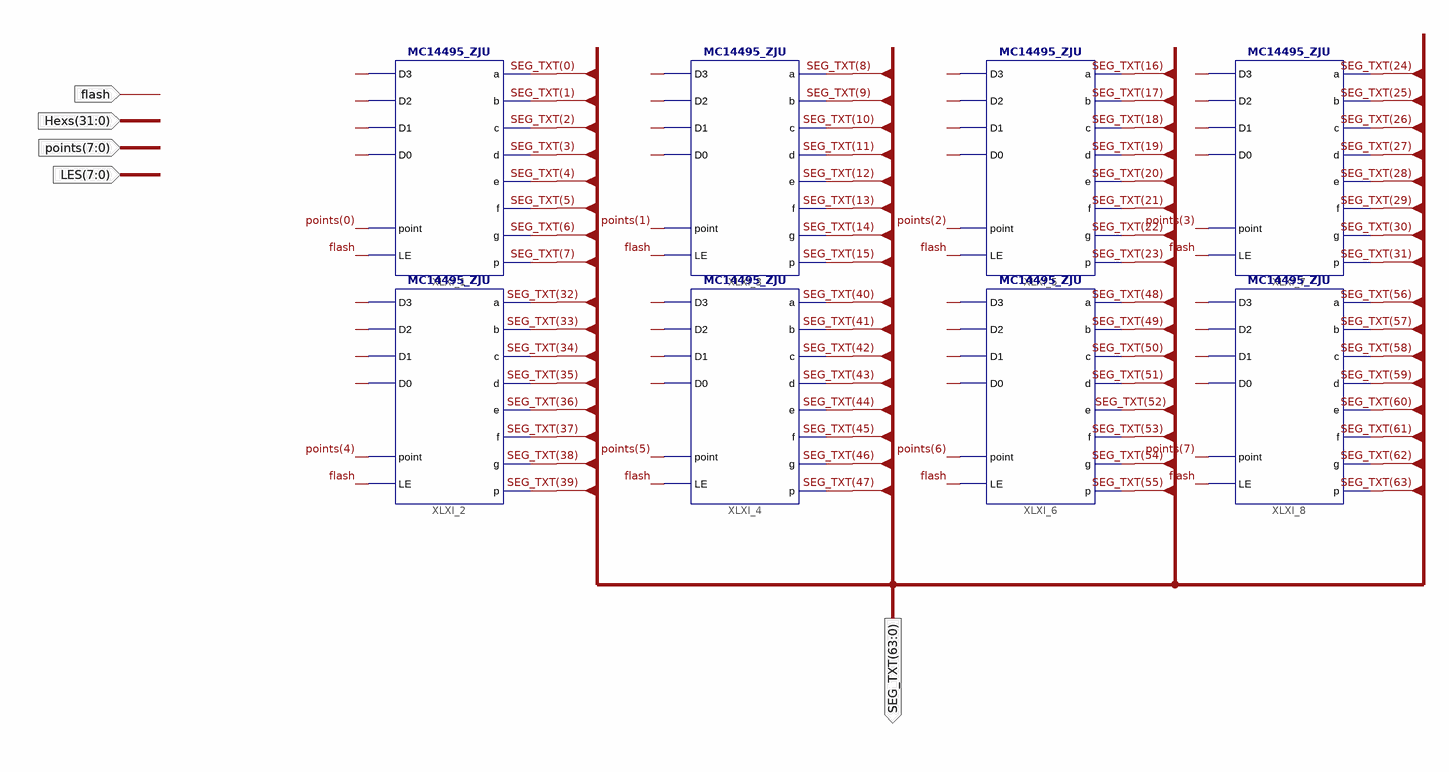
[diagram p0: schematic sheet 1]
// Xilinx ISE schematic HexT8Seg.sch (kintex7) as structural Verilog: 8 symbols, 5 ports
module HexT8Seg (
  input  flash,
  input  [31:0] Hexs,
  input  [7:0] points,
  input  [7:0] LES,
  output [63:0] SEG_TXT
);

  wire XLXN_79, XLXN_80, XLXN_81, XLXN_82, XLXN_85, XLXN_86, XLXN_87, XLXN_88, XLXN_91, XLXN_92, XLXN_93,
       XLXN_94, XLXN_97, XLXN_98, XLXN_99, XLXN_100, XLXN_103, XLXN_104, XLXN_105, XLXN_106, XLXN_109,
       XLXN_110, XLXN_111, XLXN_112, XLXN_115, XLXN_116, XLXN_117, XLXN_118, XLXN_121, XLXN_122, XLXN_123,
       XLXN_124;

  MC14495_ZJU XLXI_1 (
    .a(SEG_TXT[0]), .b(SEG_TXT[1]), .c(SEG_TXT[2]), .d(SEG_TXT[3]), .D0(XLXN_79), .D1(XLXN_80), .D2(XLXN_81),
    .D3(XLXN_82), .e(SEG_TXT[4]), .f(SEG_TXT[5]), .g(SEG_TXT[6]), .p(SEG_TXT[7]), .LE(flash),
    .point(points[0]));
  MC14495_ZJU XLXI_2 (
    .a(SEG_TXT[32]), .b(SEG_TXT[33]), .c(SEG_TXT[34]), .d(SEG_TXT[35]), .D0(XLXN_85), .D1(XLXN_86),
    .D2(XLXN_87), .D3(XLXN_88), .e(SEG_TXT[36]), .f(SEG_TXT[37]), .g(SEG_TXT[38]), .p(SEG_TXT[39]),
    .LE(flash), .point(points[4]));
  MC14495_ZJU XLXI_3 (
    .a(SEG_TXT[8]), .b(SEG_TXT[9]), .c(SEG_TXT[10]), .d(SEG_TXT[11]), .D0(XLXN_91), .D1(XLXN_92),
    .D2(XLXN_93), .D3(XLXN_94), .e(SEG_TXT[12]), .f(SEG_TXT[13]), .g(SEG_TXT[14]), .p(SEG_TXT[15]),
    .LE(flash), .point(points[1]));
  MC14495_ZJU XLXI_4 (
    .a(SEG_TXT[40]), .b(SEG_TXT[41]), .c(SEG_TXT[42]), .d(SEG_TXT[43]), .D0(XLXN_97), .D1(XLXN_98),
    .D2(XLXN_99), .D3(XLXN_100), .e(SEG_TXT[44]), .f(SEG_TXT[45]), .g(SEG_TXT[46]), .p(SEG_TXT[47]),
    .LE(flash), .point(points[5]));
  MC14495_ZJU XLXI_5 (
    .a(SEG_TXT[16]), .b(SEG_TXT[17]), .c(SEG_TXT[18]), .d(SEG_TXT[19]), .D0(XLXN_103), .D1(XLXN_104),
    .D2(XLXN_105), .D3(XLXN_106), .e(SEG_TXT[20]), .f(SEG_TXT[21]), .g(SEG_TXT[22]), .p(SEG_TXT[23]),
    .LE(flash), .point(points[2]));
  MC14495_ZJU XLXI_6 (
    .a(SEG_TXT[48]), .b(SEG_TXT[49]), .c(SEG_TXT[50]), .d(SEG_TXT[51]), .D0(XLXN_109), .D1(XLXN_110),
    .D2(XLXN_111), .D3(XLXN_112), .e(SEG_TXT[52]), .f(SEG_TXT[53]), .g(SEG_TXT[54]), .p(SEG_TXT[55]),
    .LE(flash), .point(points[6]));
  MC14495_ZJU XLXI_7 (
    .a(SEG_TXT[24]), .b(SEG_TXT[25]), .c(SEG_TXT[26]), .d(SEG_TXT[27]), .D0(XLXN_121), .D1(XLXN_122),
    .D2(XLXN_123), .D3(XLXN_124), .e(SEG_TXT[28]), .f(SEG_TXT[29]), .g(SEG_TXT[30]), .p(SEG_TXT[31]),
    .LE(flash), .point(points[3]));
  MC14495_ZJU XLXI_8 (
    .a(SEG_TXT[56]), .b(SEG_TXT[57]), .c(SEG_TXT[58]), .d(SEG_TXT[59]), .D0(XLXN_115), .D1(XLXN_116),
    .D2(XLXN_117), .D3(XLXN_118), .e(SEG_TXT[60]), .f(SEG_TXT[61]), .g(SEG_TXT[62]), .p(SEG_TXT[63]),
    .LE(flash), .point(points[7]));
endmodule
